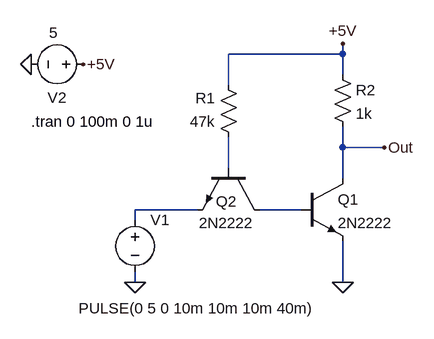
[diagram p0: schematic TTL.asc]
TTL.asc, the LTspice schematic file:
Version 4
SHEET 1 880 680
WIRE 176 -96 176 -112
WIRE 176 -96 0 -96
WIRE 176 -64 176 -96
WIRE 0 -48 0 -96
WIRE 176 48 176 16
WIRE 240 48 176 48
WIRE 0 80 0 32
WIRE 176 96 176 48
WIRE -48 144 -144 144
WIRE 112 144 48 144
WIRE -144 160 -144 144
WIRE -144 256 -144 240
WIRE 176 256 176 192
FLAG 176 256 0
FLAG 176 -112 +5V
FLAG 240 48 Out
FLAG -144 256 0
FLAG -304 -80 0
FLAG -224 -80 +5V
SYMBOL res 16 48 R180
WINDOW 0 36 76 Left 2
WINDOW 3 36 40 Left 2
SYMATTR InstName R1
SYMATTR Value 47k
SYMBOL npn 112 96 R0
SYMATTR InstName Q1
SYMATTR Value 2N2222
SYMBOL res 160 -80 R0
SYMATTR InstName R2
SYMATTR Value 1k
SYMBOL voltage -144 144 R0
WINDOW 123 0 0 Left 0
WINDOW 39 0 0 Left 0
WINDOW 3 -87 152 Left 2
SYMATTR InstName V1
SYMATTR Value PULSE(0 5 0 10m 10m 10m 40m)
SYMBOL voltage -208 -80 R90
WINDOW 123 0 0 Left 0
WINDOW 39 0 0 Left 0
WINDOW 0 51 41 VRight 2
WINDOW 3 -49 55 VRight 2
SYMATTR InstName V2
SYMATTR Value 5
SYMBOL npn 48 80 R90
WINDOW 0 51 35 VRight 2
WINDOW 3 84 9 VRight 2
SYMATTR InstName Q2
SYMATTR Value 2N2222
TEXT -304 8 Left 2 !.tran 0 100m 0 1u

The netlist it stands for:
* TTL.asc
R1 N001 +5V 47k
Q1 Out N003 0 0 2N2222
R2 +5V Out 1k
V1 N002 0 PULSE(0 5 0 10m 10m 10m 40m)
V2 +5V 0 5
Q2 N003 N001 N002 0 2N2222
.model NPN NPN
.model PNP PNP
.lib standard.bjt
.tran 0 100m 0 1u
.backanno
.end